# Altium schematic sheet [11] - MAIN CLOCKS.SchDoc
size A3; DocumentNumber: 11; SheetNumber: 11; SheetTotal: 15
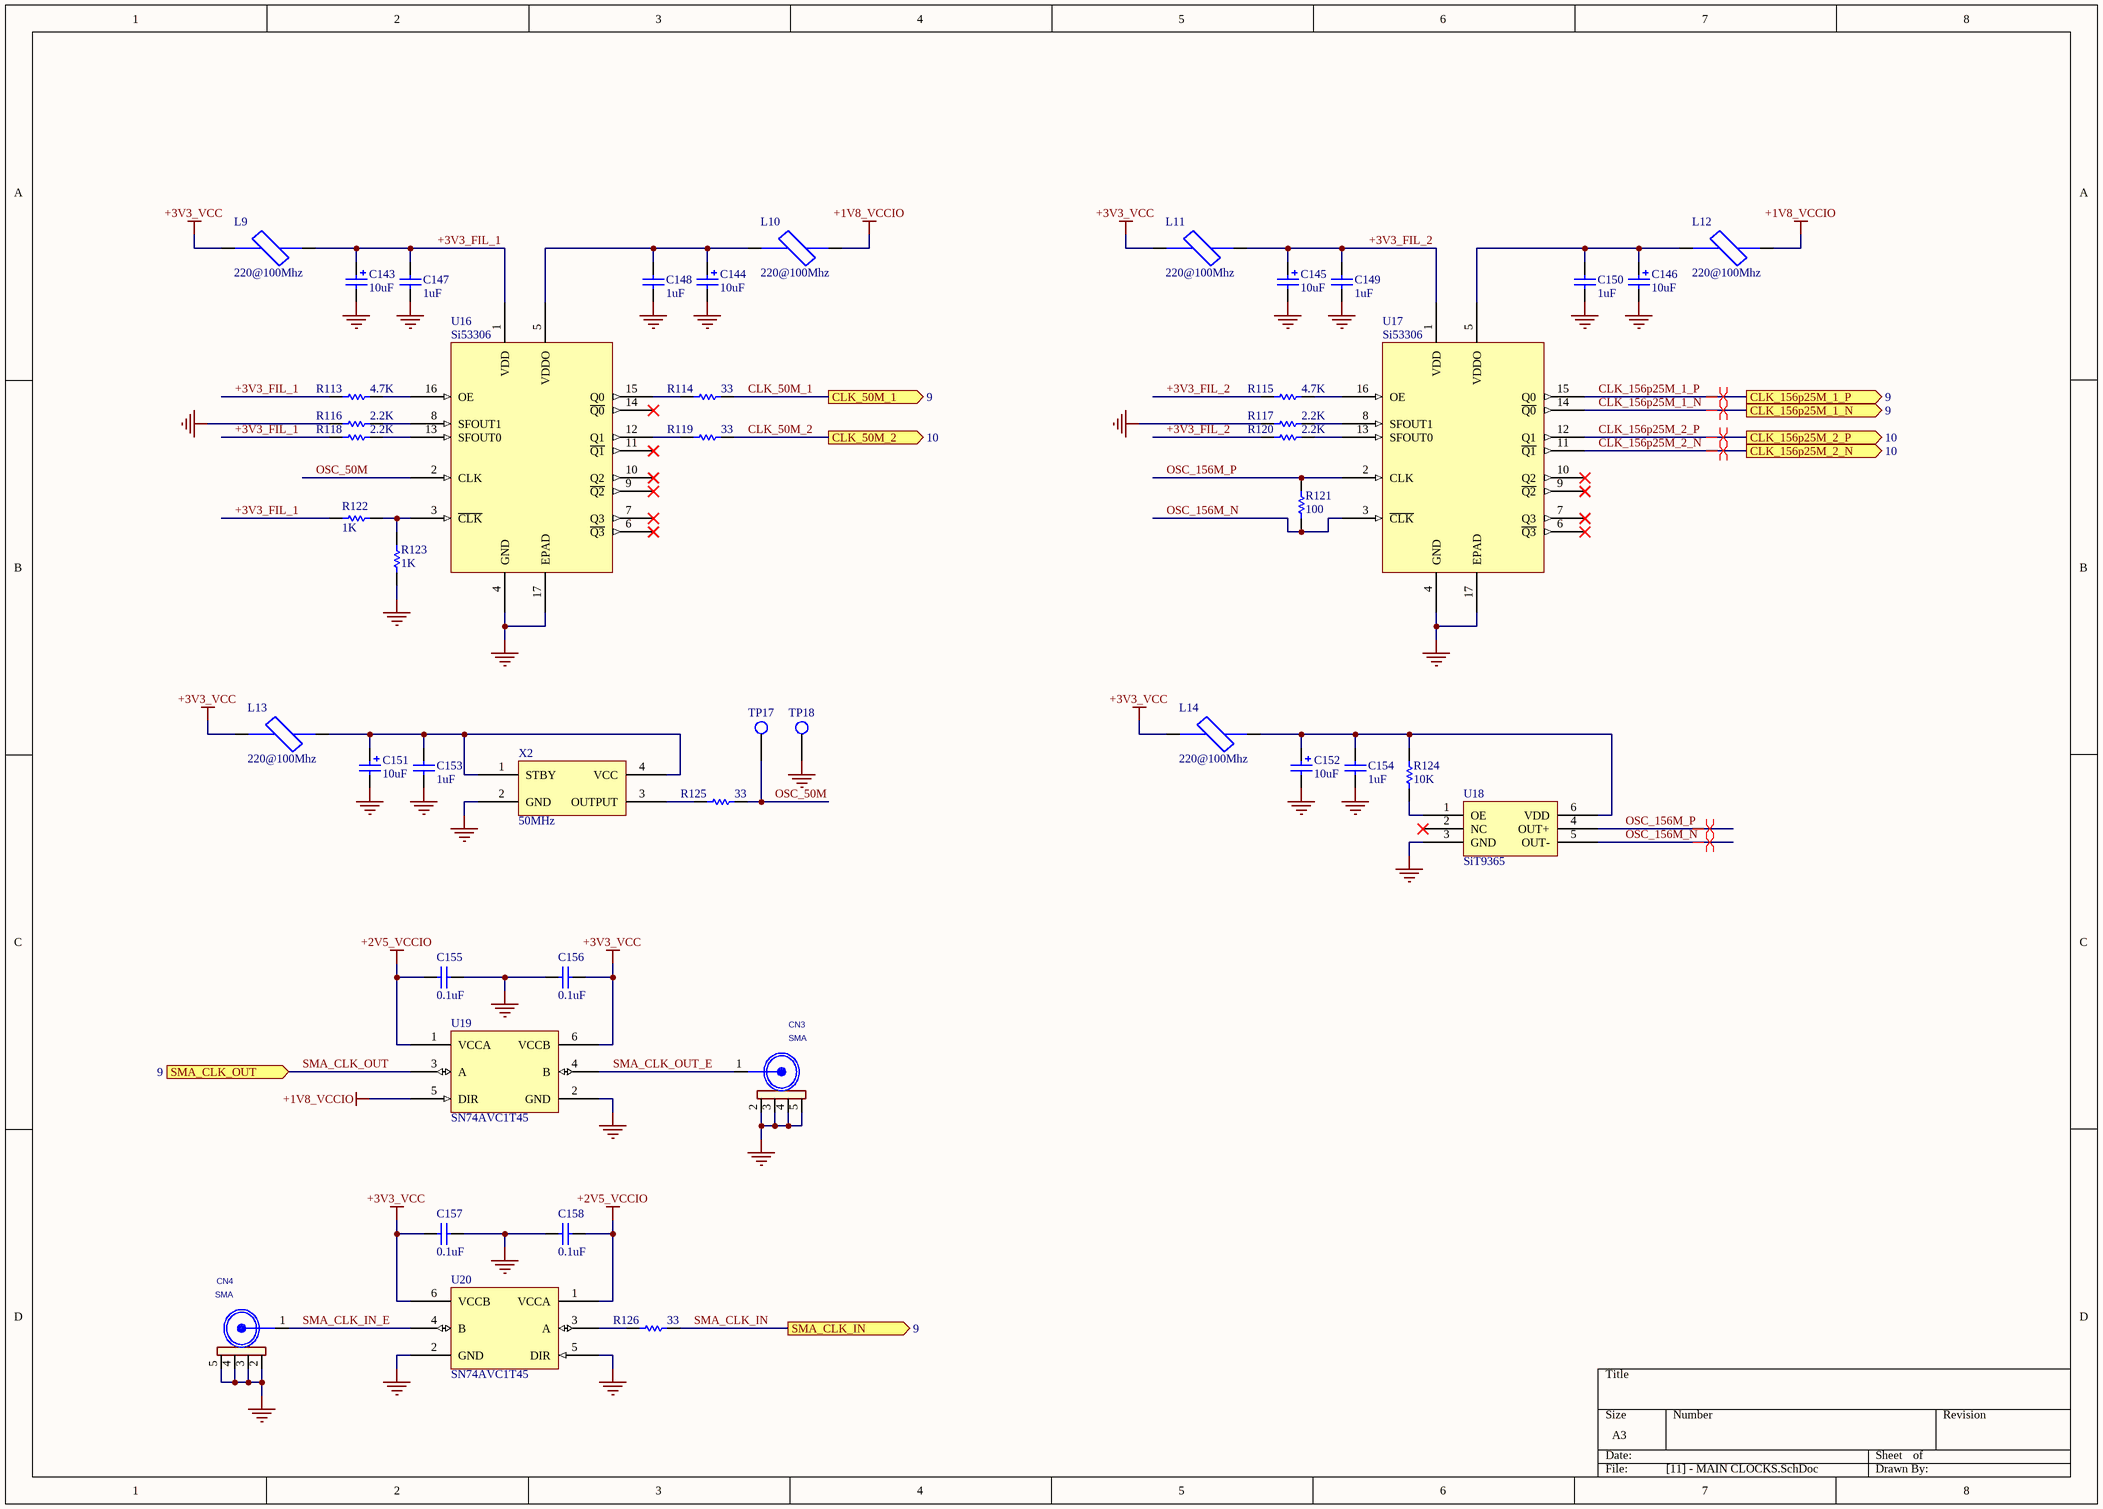
[diagram p0: [11] - MAIN CLOCKS.SchDoc]

## Parts
C143  10uF  [TANT_B]
C144  10uF  [TANT_B]
C145  10uF  [TANT_B]
C146  10uF  [TANT_B]
C147  1uF  [0402_C]
C148  1uF  [0402_C]
C149  1uF  [0402_C]
C150  1uF  [0402_C]
C151  10uF  [TANT_B]
C152  10uF  [TANT_B]
C153  1uF  [0402_C]
C154  1uF  [0402_C]
C155  0.1uF  [0402_C]
C156  0.1uF  [0402_C]
C157  0.1uF  [0402_C]
C158  0.1uF  [0402_C]
CN3  SMA  [SMA_STRAIGHT]
CN4  SMA  [SMA_STRAIGHT]
L9  220@100Mhz  [0805_L]
L10  220@100Mhz  [0805_L]
L11  220@100Mhz  [0805_L]
L12  220@100Mhz  [0805_L]
L13  220@100Mhz  [0805_L]
L14  220@100Mhz  [0805_L]
R113  4.7K  [0402_R]
R114  33  [0402_R]
R115  4.7K  [0402_R]
R116  2.2K  [0402_R]
R117  2.2K  [0402_R]
R118  2.2K  [0402_R]
R119  33  [0402_R]
R120  2.2K  [0402_R]
R121  100  [0402_R]
R122  1K  [0402_R]
R123  1K  [0402_R]
R124  10K  [0402_R]
R125  33  [0402_R]
R126  33  [0402_R]
TP17  Test Point  [PIN_1mm]  (value not drawn)
TP18  Test Point  [PIN_1mm]  (value not drawn)
U16  Si53306
U17  Si53306
U18  SiT9365
U19  SN74AVC1T45
U20  SN74AVC1T45
X2  50MHz  [OSC_3.2x2.5]

## Ports
CLK_50M_1 (out, see 9), CLK_50M_2 (out, see 10), CLK_156p25M_1_N (out, see 9), CLK_156p25M_1_P (out, see 9), CLK_156p25M_2_N (out, see 10), CLK_156p25M_2_P (out, see 10), SMA_CLK_IN (out, see 9), SMA_CLK_OUT (in, see 9)

## Nets
+1V8_VCCIO: L10.2 L12.2 U19.5(DIR)
+2V5_VCCIO: C155.2 C158.1 U19.1(VCCA) U20.1(VCCA)
+3V3_VCC: C156.1 C157.2 L9.1 L11.1 L13.1 L14.1 U19.6(VCCB) U20.6(VCCB)
GND: C143.2 C144.2 C145.2 C146.2 C147.1 C148.1 C149.1 C150.1 C151.2 C152.2 C153.1 C154.1 C155.1 C156.2 C157.1 C158.2 CN3.2 CN3.3 CN3.4 CN3.5 CN4.2 CN4.3 CN4.4 CN4.5 R116.1 R117.1 R123.1 TP18.1 U16.4(GND) U16.17(EPAD) U17.4(GND) U17.17(EPAD) U18.3(GND) U19.2(GND) U20.2(GND) U20.5(DIR) X2.2(GND)
+3V3_FIL_1: C143.1 C147.2 L9.2 R113.1 R118.1 R122.1 U16.1(VDD)
+3V3_FIL_2: C145.1 C149.2 L11.2 R115.1 R120.1 U17.1(VDD)
CLK_50M_1: R114.2 ; port CLK_50M_1
CLK_50M_2: R119.2 ; port CLK_50M_2
CLK_156p25M_1_N: U17.14(~{Q0}) ; port CLK_156p25M_1_N
CLK_156p25M_1_P: U17.15(Q0) ; port CLK_156p25M_1_P
CLK_156p25M_2_N: U17.11(~{Q1}) ; port CLK_156p25M_2_N
CLK_156p25M_2_P: U17.12(Q1) ; port CLK_156p25M_2_P
OSC_50M: R125.2 TP17.1 U16.2(CLK)
OSC_156M_N: R121.1 U17.3(~{CLK}) U18.5(OUT-)
OSC_156M_P: R121.2 U17.2(CLK) U18.4(OUT+)
SMA_CLK_IN: R126.2 ; port SMA_CLK_IN
SMA_CLK_IN_E: CN4.1 U20.4(B)
SMA_CLK_OUT: U19.3(A) ; port SMA_CLK_OUT
SMA_CLK_OUT_E: CN3.1 U19.4(B)
NetC144_1: C144.1 C148.2 L10.1 U16.5(VDDO)
NetC146_1: C146.1 C150.2 L12.1 U17.5(VDDO)
NetC151_1: C151.1 C153.2 L13.2 X2.1(STBY) X2.4(VCC)
NetC152_1: C152.1 C154.2 L14.2 R124.2 U18.6(VDD)
NetR113_2: R113.2 U16.16(OE)
NetR114_1: R114.1 U16.15(Q0)
NetR115_2: R115.2 U17.16(OE)
NetR116_2: R116.2 U16.8(SFOUT1)
NetR117_2: R117.2 U17.8(SFOUT1)
NetR118_2: R118.2 U16.13(SFOUT0)
NetR119_1: R119.1 U16.12(Q1)
NetR120_2: R120.2 U17.13(SFOUT0)
NetR122_2: R122.2 R123.2 U16.3(~{CLK})
NetR124_1: R124.1 U18.1(OE)
NetR125_1: R125.1 X2.3(OUTPUT)
NetR126_1: R126.1 U20.3(A)

Not connected (* = marked no-connect by the designer): U16 6(~{Q3})* 7(Q3)* 9(~{Q2})* 10(Q2)* 11(~{Q1})* 14(~{Q0})*; U17 6(~{Q3})* 7(Q3)* 9(~{Q2})* 10(Q2)*; U18 2(NC)*

## Layout directives
differential pair: CLK_156p25M_1_N, CLK_156p25M_1_P, CLK_156p25M_2_N, CLK_156p25M_2_P, OSC_156M_N, OSC_156M_P

## Library data of the parts
C143-C146 C151 C152 = Cap Tant: Tantalum Polarized Capacitor; RATED_VOLTAGE: 6.3V; Value: 10uF
C147-C150 C153 C154 = Cap SMD: Non-Pol SMD Capacitor; RATED_VOLTAGE: 16V; Value: 1uF; Manufacturer Part Num: *; Dielectric: *
C155-C158 = Cap SMD: Non-Pol SMD Capacitor; RATED_VOLTAGE: 25V; Value: 0.1uF; Manufacturer Part Num: *; Dielectric: *
CN3 CN4 = SMA Straight: CONN -  SMA VERTICAL GOLD PLATED SMT CENTER CONDUCTOR; Value: SMA; Manufacturer Part Num: *
L9-L14 = Ferrite Bead: Value: 220@100Mhz
R113-R126 = Res SMD: SMD Resistor; Tolerance: 5%; Manufacturer Part Num: *
  R113 R115: Value: 4.7K
  R114 R119 R125 R126: Value: 33
  R116-R118 R120: Value: 2.2K
  R121: Value: 100
  R122 R123: Value: 1K
  R124: Value: 10K
TP17 TP18 = Test Point: Test Point Footprint; Value: Test Point
U16 U17 = Si53306: Ultra-Low Additive Jitter Fanout Clock Buffer; Manufacturer Part Num: Si53306-B-GM; Value: Si53306
U18 = SiT9365: Standard Frequency Ultra-low Jitter Differential Oscillator; Manufacturer Part Num: SIT9365AC-2B2-33E156.250000G; Value: SiT9365
U19 U20 = SN74AVC1T45: Single-Bit Dual-Supply Bus Transceiver With Configurable Voltage Translation; Value: SN74AVC1T45; Manufacturer Part Num: *
X2 = XTAL OSC: Crystal Oscillator; Value: 50MHz